# Altium project BoardB.PrjPcb (part 2 of 2)

## Sheet BoardB.SchDoc
size B; SheetNumber: 3; SheetTotal: 3
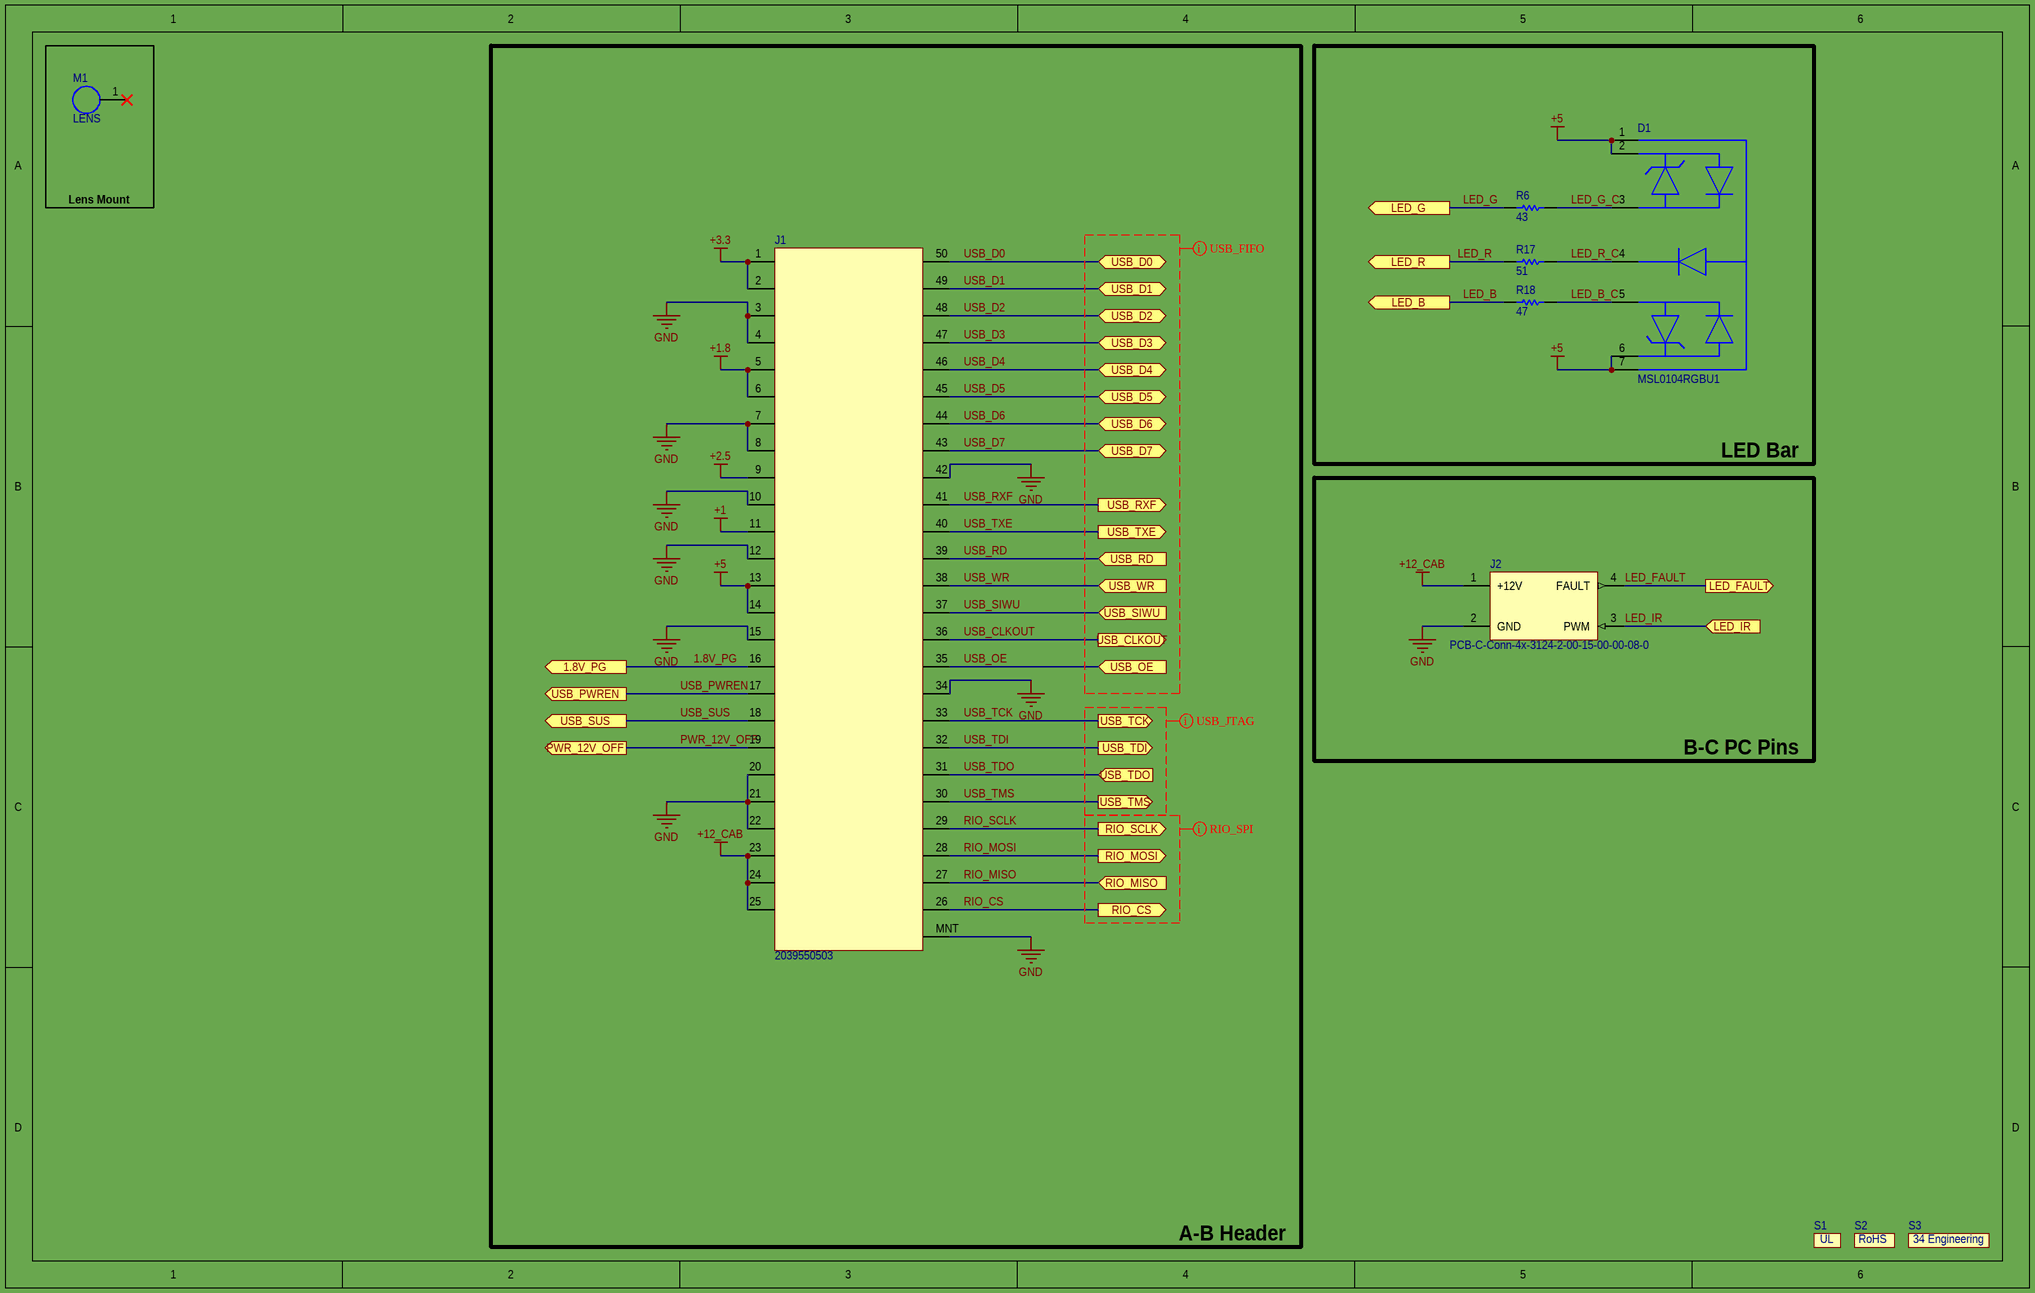
[diagram p3: BoardB.SchDoc]

### Parts
D1  MSL0104RGBU1  [FP-MSL0104-MFG]
J1  2039550503  [2039550503]
J2  PCB-C-Conn-4x-3124-2-00-15-00-00-08-0  [PCB-C-Conn-4x-3124-2-00-15-00-00-08-0]
M1  LENS  [LENS_MNT]
R6  43  [RESC0603X26X15ML03T05]
R17  51  [RESC1608X55X30NL15T15]
R18  47  [RESC1608X55X30NL15T15]
S1  (no value)  [UL]
S2  (no value)  [RoHS]
S3  (no value)  [34EngineeringLogo]

### Blocks framed on the sheet
Lens Mount: M1
A-B Header: J1
LED Bar: D1 R6 R17 R18

### Ports
1.8V_PG (out), LED_B (out), LED_FAULT (out), LED_G (out), LED_IR (in), LED_R (out), PWR_12V_OFF (out), RIO_CS (out), RIO_MISO (in), RIO_MOSI (out), RIO_SCLK (out), USB_CLKOUT (out), USB_D0 (bidir), USB_D1 (bidir), USB_D2 (bidir), USB_D3 (bidir), USB_D4 (bidir), USB_D5 (bidir), USB_D6 (bidir), USB_D7 (bidir), USB_OE (in), USB_PWREN (out), USB_RD (in), USB_RXF (out), USB_SIWU (in), USB_SUS (out), USB_TCK (out), USB_TDI (out), USB_TDO (in), USB_TMS (out), USB_TXE (out), USB_WR (in)

### Nets
+1: J1.11
+1.8: J1.5 J1.6
+2.5: J1.9
+3.3: J1.1 J1.2
+5: D1.1(R_A) D1.2(G_A) D1.6(B_A) D1.7(R_A) J1.13 J1.14
+12_CAB: J1.23 J1.24 J1.25 J2.1(+12V)
GND: J1.3 J1.4 J1.7 J1.8 J1.10 J1.12 J1.15 J1.20 J1.21 J1.22 J1.34 J1.42 J1.MNT J2.2(GND)
1.8V_PG: J1.16 ; port 1.8V_PG
LED_B: R18.1 ; port LED_B
LED_B_C: D1.5(B_K) R18.2
LED_FAULT: J2.4(FAULT) ; port LED_FAULT
LED_G: R6.1 ; port LED_G
LED_G_C: D1.3(G_K) R6.2
LED_IR: J2.3(PWM) ; port LED_IR
LED_R: R17.1 ; port LED_R
LED_R_C: D1.4(R_K) R17.2
PWR_12V_OFF: J1.19 ; port PWR_12V_OFF
RIO_CS: J1.26 ; port RIO_CS
RIO_MISO: J1.27 ; port RIO_MISO
RIO_MOSI: J1.28 ; port RIO_MOSI
RIO_SCLK: J1.29 ; port RIO_SCLK
USB_CLKOUT: J1.36 ; port USB_CLKOUT
USB_D0: J1.50 ; port USB_D0
USB_D1: J1.49 ; port USB_D1
USB_D2: J1.48 ; port USB_D2
USB_D3: J1.47 ; port USB_D3
USB_D4: J1.46 ; port USB_D4
USB_D5: J1.45 ; port USB_D5
USB_D6: J1.44 ; port USB_D6
USB_D7: J1.43 ; port USB_D7
USB_OE: J1.35 ; port USB_OE
USB_PWREN: J1.17 ; port USB_PWREN
USB_RD: J1.39 ; port USB_RD
USB_RXF: J1.41 ; port USB_RXF
USB_SIWU: J1.37 ; port USB_SIWU
USB_SUS: J1.18 ; port USB_SUS
USB_TCK: J1.33 ; port USB_TCK
USB_TDI: J1.32 ; port USB_TDI
USB_TDO: J1.31 ; port USB_TDO
USB_TMS: J1.30 ; port USB_TMS
USB_TXE: J1.40 ; port USB_TXE
USB_WR: J1.38 ; port USB_WR

Not connected (* = marked no-connect by the designer): M1 1*

### Layout directives
mark named RIO_SPI: (no net found under the mark)
mark named USB_JTAG: (no net found under the mark)
mark named USB_FIFO: (no net found under the mark)

### Notes on the sheet
- B-C PC Pins
- (in symbol 34EngineeringLogo) 34 Engineering

### Library data of the parts
D1 = CMP-08952-000007-1: LED RGB DIFFUSED 2709 SMD R/A; Manufacturer: Rohm; Forward Current: 20mA; Forward Voltage: 2.1/3.3/3.2V; Luminous Intensity: 700/1200/400mcd; Power Dissipation: 400mW; Automotive Grade: NA; Colour: Red, Green, Blue; Wavelength: 624/527/470nm; Led Orientation: Side View; Device Class L2: LEDs; Mouser Description: Standard LEDs - SMD RGB 624/527/470nm 700/1200/400mcd; Lead Free: Yes; Package: MSL0104; RoHS: TRUE; Device Class L3: unset; Manufacturer Part Number: MSL0104RGBU1; Automotive: No; Octopart: https://octopart.com/msl0104rgbu1-rohm-71139759; Temperature Range High: +85°C; ComponentLink2URL: https://www.rohm.com/datasheet/MSL0104RGBU/msl0104rgb-e; ComponentLink2Description: Datasheet; Category: Diode; Temperature: -40°C to +85°C; Temperature Range Low: -40°C; Height: 2.35mm; Digikey Description: LED RGB DIFFUSED 2709 SMD R/A; Device Class L1: Optoelectronics
J1 = 2039550503: SlimStack Board-to-Board Receptacle, 0.40mm Pitch, FSB5 Floating Series, 5.00mm Mated Height, 3.80mm Mated Width, 50 Circuits; Manufacturer: Molex; Manufacturer Part Number: 203955-0503; Supplier 1: Mouser; RoHS: No; Stock 1: 5216; Pricing 1: 1=2.91000, 10=2.57000, 50=2.69000, 100=2.04000, 1000=1.78000, 2200=1.72000, 8800=1.68000, 10000=1.58000 (USD); Supplier Part Number 1: 538-203956-0503
M1 = LENS_MNT
R6 = CMP-2004-03548-1: Manufacturer: Panasonic; Part Number: ERJ1GNF43R0C
R17 = CMP-2000-00547-1: Part Number: ERJ3EKF51R0V; Manufacturer: Panasonic
R18 = CMP-2000-00529-2: Chip Resistor, 47 Ohm, +/- 1%, 0.1 W, -55 to 155 degC, 0603 (1608 Metric), RoHS, Tape and Reel; Power Rating: 100 mW; Case\Package: 0603; Voltage Rating (DC): 50 V; Resistance: 6.8 kohm; Length: 1.6 mm; Case Code (Metric): 1608; Packaging: Tape and Reel; Min Operating Temperature: -55 degC; DatasheetVersion: Apr-15; PackageReference: 0603; Case Code (Imperial): 0603; PackageDescription: 2-Pin Surface Mount Device, Body 1.6 x 0.85 mm; Tolerance: 1%; Height: 0.45 mm; RoHSCompliant: true; ComponentLink2Description: Datasheet; Pins: 2; ComponentLink1URL: http://www.panasonic.com/; Package Quantity: 5000; REACH SVHC: No SVHC; ComponentLink2URL: http://industrial.panasonic.com/cdbs/www-data/pdf/RDA0000/AOA0000C86.pdf; Width: 0.8 mm; Mount: Surface Mount; Max Operating Temperature: 155 degC; ComponentLink1Description: Manufacturer URL; Voltage Rating: 50 V
S1 = UL
S2 = RoHS
S3 = 34EngineeringLogo: 34 Engineering Silkscreen Logo

## Nets that join several sheets
+1: BoardB-FPGA (16 pins), BoardB (J1.11)
+1.8: BoardB-Python (11 pins), BoardB-FPGA (11 pins), BoardB (J1.5 J1.6)
+2.5: BoardB-FPGA (13 pins), BoardB (J1.9)
+3.3: BoardB-Python (5 pins), BoardB-FPGA (54 pins), BoardB (J1.1 J1.2)
+5: BoardB-Python (8 pins), BoardB (6 pins)
GND: BoardB-Python (51 pins), BoardB-FPGA (88 pins), BoardB (14 pins)
1.8V_PG: BoardB-Python (U5.3), BoardB (J1.16)
CAM_CLK_EN: BoardB-Python (R4.1 U5.4 X3.1), BoardB-FPGA (U1.M14)
CAM_CLK_N: BoardB-Python (U3.7), BoardB-FPGA (U1.C4)
CAM_CLK_P: BoardB-Python (U3.8), BoardB-FPGA (U1.D4)
CAM_DOUT0_N: BoardB-Python (U3.9), BoardB-FPGA (U1.C2)
CAM_DOUT0_P: BoardB-Python (U3.10), BoardB-FPGA (U1.C3)
CAM_DOUT1_N: BoardB-Python (U3.11), BoardB-FPGA (U1.E5)
CAM_DOUT1_P: BoardB-Python (U3.12), BoardB-FPGA (U1.F5)
CAM_DOUT2_N: BoardB-Python (U3.13), BoardB-FPGA (U1.G4)
CAM_DOUT2_P: BoardB-Python (U3.14), BoardB-FPGA (U1.G5)
CAM_DOUT3_N: BoardB-Python (U3.15), BoardB-FPGA (U1.D5)
CAM_DOUT3_P: BoardB-Python (U3.16), BoardB-FPGA (U1.D6)
CAM_MON0: BoardB-Python (U3.44), BoardB-FPGA (U1.R10)
CAM_MON1: BoardB-Python (U3.45), BoardB-FPGA (U1.R6)
CAM_RESET: BoardB-Python (R1.2 U3.46), BoardB-FPGA (U1.R5)
CAM_SPI_CLK: BoardB-Python (U3.4), BoardB-FPGA (U1.T7)
CAM_SPI_CS: BoardB-Python (U3.47), BoardB-FPGA (U1.T10)
CAM_SPI_MISO: BoardB-Python (U3.3), BoardB-FPGA (U1.T8)
CAM_SPI_MOSI: BoardB-Python (U3.2), BoardB-FPGA (U1.T9)
CAM_SYNC_N: BoardB-Python (U3.17), BoardB-FPGA (U1.C6)
CAM_SYNC_P: BoardB-Python (U3.18), BoardB-FPGA (U1.C7)
CAM_TRIG0: BoardB-Python (U3.41), BoardB-FPGA (U1.R13)
CAM_TRIG1: BoardB-Python (U3.42), BoardB-FPGA (U1.P11)
CAM_TRIG2: BoardB-Python (U3.43), BoardB-FPGA (U1.R11)
LED_B: BoardB-FPGA (U1.R1 U1.R2), BoardB (R18.1)
LED_FAULT: BoardB-FPGA (U1.N6), BoardB (J2.4)
LED_G: BoardB-FPGA (U1.M1 U1.M2), BoardB (R6.1)
LED_IR: BoardB-FPGA (R7.1 U1.P6), BoardB (J2.3)
LED_R: BoardB-FPGA (U1.N1 U1.N2), BoardB (R17.1)
PWR_12V_OFF: BoardB-FPGA (U1.N16), BoardB (J1.19)
RIO_CS: BoardB-FPGA (U1.T15), BoardB (J1.26)
RIO_MISO: BoardB-FPGA (U1.R15), BoardB (J1.27)
RIO_MOSI: BoardB-FPGA (U1.R16), BoardB (J1.28)
RIO_SCLK: BoardB-FPGA (U1.P14), BoardB (J1.29)
USB_CLKOUT: BoardB-FPGA (U1.D13), BoardB (J1.36)
USB_D0: BoardB-FPGA (U1.A15), BoardB (J1.50)
USB_D1: BoardB-FPGA (U1.B16), BoardB (J1.49)
USB_D2: BoardB-FPGA (U1.B15), BoardB (J1.48)
USB_D3: BoardB-FPGA (U1.C16), BoardB (J1.47)
USB_D4: BoardB-FPGA (U1.D16), BoardB (J1.46)
USB_D5: BoardB-FPGA (U1.D15), BoardB (J1.45)
USB_D6: BoardB-FPGA (U1.E16), BoardB (J1.44)
USB_D7: BoardB-FPGA (U1.E15), BoardB (J1.43)
USB_OE: BoardB-FPGA (U1.J15), BoardB (J1.35)
USB_PWREN: BoardB-FPGA (U1.B14), BoardB (J1.17)
USB_RD: BoardB-FPGA (U1.G15), BoardB (J1.39)
USB_RXF: BoardB-FPGA (U1.F15), BoardB (J1.41)
USB_SIWU: BoardB-FPGA (U1.J16), BoardB (J1.37)
USB_SUS: BoardB-FPGA (U1.H14), BoardB (J1.18)
USB_TCK: BoardB-FPGA (U1.L7), BoardB (J1.33)
USB_TDI: BoardB-FPGA (U1.N7), BoardB (J1.32)
USB_TDO: BoardB-FPGA (U1.N8), BoardB (J1.31)
USB_TMS: BoardB-FPGA (U1.M7), BoardB (J1.30)
USB_TXE: BoardB-FPGA (U1.G16), BoardB (J1.40)
USB_WR: BoardB-FPGA (U1.H16), BoardB (J1.38)